# EAGLE design DS18B20 (EAGLE 7.4.0)
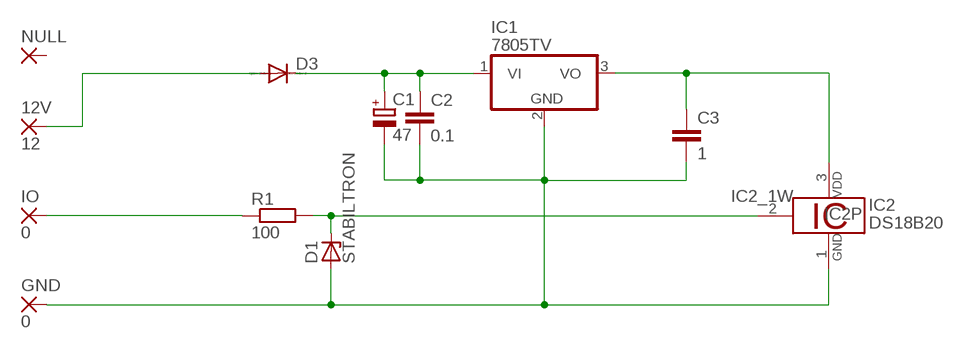
[diagram p0: schematic, sheet 1]

## Parts
12V  12  3,81/1,4  [3,81/1,4]
C1  47  CPOL-EUE2.5-5  [E2,5-5]
C2  0.1  C-EUC0805  [C0805]
C3  1  C-EUC0805  [C0805]
D1  STABILTRON  ZENER-DIODESOD80C  [SOD80C]
D3  DIODE-SOD80C  [SOD80C]
GND  0  3,81/1,4  [3,81/1,4]
IC1  7805TV  [TO220V]
IC2  DS18B20  [TO92-]
IO  0  3,81/1,4  [3,81/1,4]
NULL  3,81/1,4  [3,81/1,4]
R1  100  R-EU_R0805  [R0805]

## Nets
N$1: 12V.1(P) D3.A
N$2: IO.1(P) R1.1
N$3: C3.1 IC1.3(VO) IC2.3
N$4: C1.- C2.2 C3.2 D1.A GND.1(P) IC1.2(GND) IC2.1
N$7: D1.C IC2.2 R1.2
N$20: C1.+ C2.1 D3.C IC1.1(VI)
Unconnected: NULL.1(P)

## Library data of the parts
12V GND IO NULL = wirepad:3,81/1,4: THROUGH-HOLE PAD
C1 = rcl:CPOL-EU: POLARIZED CAPACITOR, European symbol
C2 C3 = rcl:C-EU: CAPACITOR, European symbol
D1 = diode:ZENER-DIODE: Z-Diode
D3 = diode:DIODE-: DIODE
IC1 = linear:78*: Positive VOLTAGE REGULATOR Source: http://cache.national.com/ds/LM/LM78L05.pdf http://www.fairchildsemi.com/ds/LM/LM7805.pdf
IC2 = 1wire:DS18B20: Programmable Resolution Digital Thermometer This chip provides a onewire thermosensor with approx. 0.5°C accuracy. A programmable over/undertemperure alarm is available. The precision can be set from 9..12 bits. Notes: Vdd must be applied for accurate measurements at low temperatures, as the parasite power circuit otherwise heats the sensor. If parasite power is used, Vdd has to be connected to GND. The DS1822 is a low-cost thermometer chip, the DS18S20 is similar to the DS18B20, but with 9 Bit precision only. Author: Jan Kandziora <jjj@gmx.de>
R1 = resistor:R-EU_: RESISTOR, European symbol

## Board
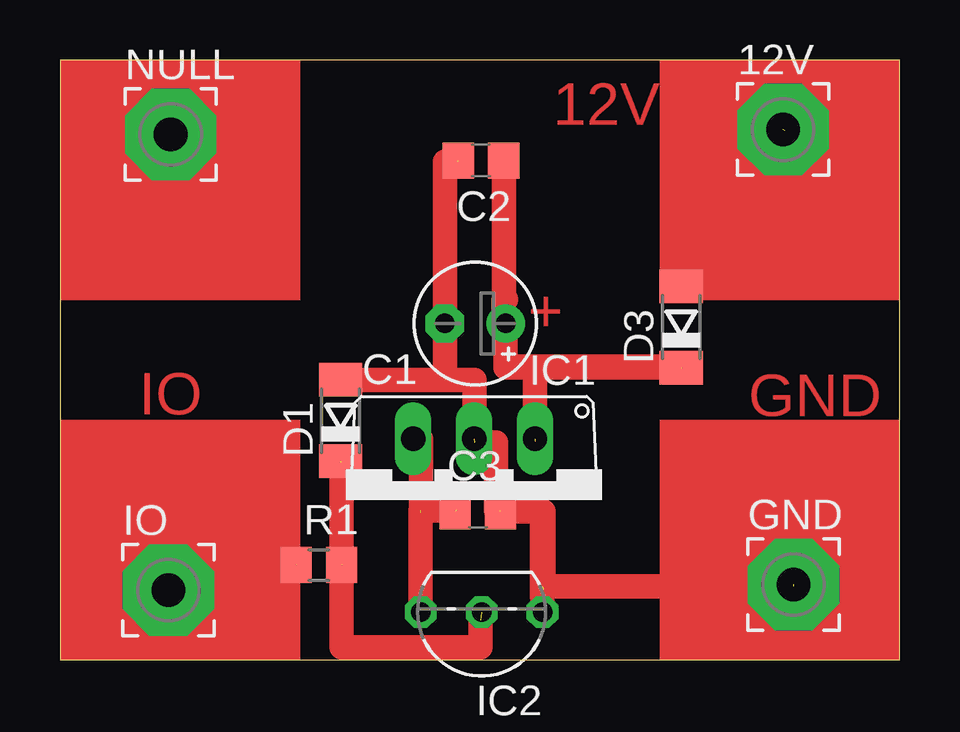
[diagram p1: board, top side]

Size 35 x 25 mm. Coordinates in mm from the lower left corner, seen from the top.
Outline: 0,0 35,0 35,25 0,25 0,0
Copper layers (1*16): Top 0.035mm / dielectric 1.5mm / Bottom 0.035mm
Design rules "default": minimum track width 10mil, minimum drill 24mil, track to track 8mil, track to pad 8mil, pad to pad 8mil, via to via 8mil, smd to smd 8mil, copper to edge 40mil, drill to drill 8mil, minimum pad ring 10mil, minimum via ring 8mil, stop-mask expansion 4mil, vias tented up to drill 0mil, thermal gap 10mil

### Footprints (pad centres in the part's own frame; a part is rotated, then mirrored left to right if it is on the bottom)
3,81/1,4 = drill 1.397 pad 3.81 octagon: 1 0,0
E2,5-5 = drill 0.813 pad 1.6: + -1.27,0 | drill 0.813 pad 1.6 octagon: - 1.27,0
C0805 = smd 1.3 x 1.5: 1 -0.95,0; 2 0.95,0
SOD80C = smd 1.4 x 1.8: A 1.7,0; C -1.7,0
TO220V = drill 1.016 long: 1 -2.54,-2.54; 2 0,-2.54; 3 2.54,-2.54
TO92- = drill 0.813 octagon: 1 -2.54,0; 2 0,0; 3 2.54,0
R0805 = smd 1.3 x 1.5: 1 -0.95,0; 2 0.95,0

### Placement (x,y rotation side)
12V  30.15,22.1 0 top
C1  17.31,14.01 180 top
C2  17.55,20.81 180 top
C3  17.42,6.18 0 top
D1  11.7,9.97 90 top
D3  25.9,13.86 90 top
GND  30.58,3.13 0 top
IC1  17.26,6.66 180 top
IC2  17.58,1.98 180 top
IO  4.52,2.89 0 top
NULL  4.62,21.89 0 top
R1  10.79,3.94 0 top

### Tracks (layer width: path | path; a pad name or v marks a point on that pad's centre or on a via)
N$1  (1 unrouted)
  Top 1.016: D3.A 25.9,22.06 30.22,22.06
N$2  (1 unrouted)
  Top 1.016: IO.1 4.52,3.98 9.84,3.98
N$3  (2 unrouted)
  Top 1.016: IC2.3 15.04,6.22 16.53,6.22 | IC1.3 15.05,9.2 15.05,6.14
N$4  (6 unrouted)
  Top 0.61: C1.- 16.08,15.01 16.08,11.73
  Top 1.016: D1.A 16.06,11.66 | 16.06,11.66 16.06,20.77 16.6,20.77 | IC2.1 20.09,3.05 30.58,3.05 | 20.09,2.92 20.09,6.18 C3.2 20.16,6.18 20.16,2.95 | 16.06,11.66 17.29,11.66 17.29,9.05 18.18,9.05 18.18,6.22 18.35,6.22
N$7  (3 unrouted)
  Top 1.016: R1.2 11.74,8.21 11.7,8.21 | 17.53,1.64 17.53,0.51 11.73,0.51 11.73,3.98 11.76,3.98
N$20  (3 unrouted)
  Top 1.016: C2.1 18.5,15 | 18.5,15 18.59,15 | C1.+ 18.58,12.18 19.79,12.18 | 19.79,12.18 25.9,12.18 25.9,12.21 18.59,12.21 | 19.79,12.18 19.79,9.1 | 18.5,15 18.5,13.97
(copper drawn outside any net)
  shapes: Top area x4

### Text on the board
Top: 12V | + | IO | GND